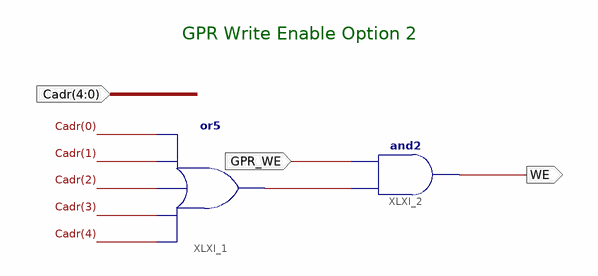
[diagram p0: schematic sheet 1]
// Xilinx ISE schematic GPR_WE_opt2.sch (spartan6) as structural Verilog: 2 symbols, 3 ports
module GPR_WE_opt2 (
  input  GPR_WE,
  input  [4:0] Cadr,
  output WE
);

  wire XLXN_6;

  or XLXI_1 (XLXN_6, Cadr[4], Cadr[3], Cadr[2], Cadr[1], Cadr[0]);
  and XLXI_2 (WE, XLXN_6, GPR_WE);

  // Notes on the sheet:
  //   GPR Write Enable Option 2
endmodule
